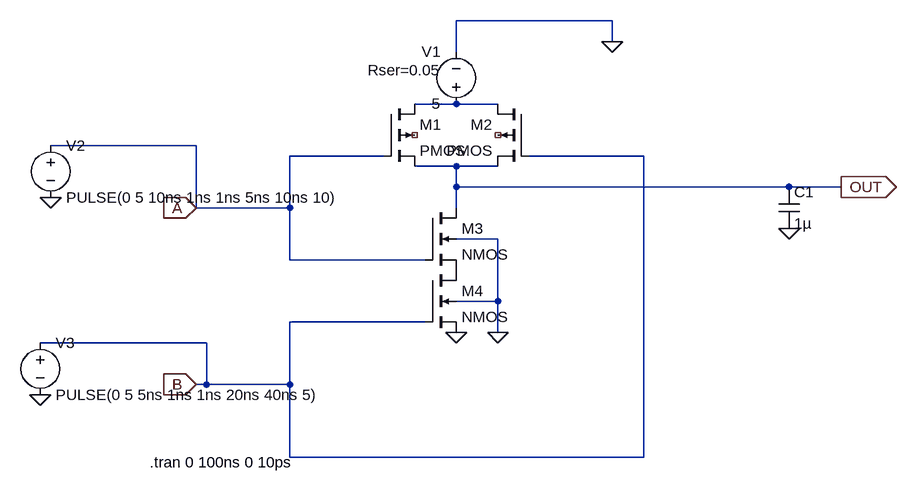
[diagram p0: schematic NAND.asc]
NAND.asc, the LTspice schematic file:
Version 4
SHEET 1 880 680
WIRE -256 -800 -496 -800
WIRE -256 -768 -256 -800
WIRE -496 -752 -496 -800
WIRE -496 -672 -560 -672
WIRE -432 -672 -496 -672
WIRE -896 -608 -1120 -608
WIRE -608 -592 -752 -592
WIRE -208 -592 -384 -592
WIRE -496 -576 -560 -576
WIRE -432 -576 -496 -576
WIRE -496 -544 -496 -576
WIRE 16 -544 -496 -544
WIRE 96 -544 16 -544
WIRE -896 -512 -896 -608
WIRE -752 -512 -752 -592
WIRE -752 -512 -896 -512
WIRE -496 -512 -496 -544
WIRE -432 -464 -496 -464
WIRE -752 -432 -752 -512
WIRE -544 -432 -752 -432
WIRE -432 -368 -432 -464
WIRE -432 -368 -496 -368
WIRE -544 -336 -752 -336
WIRE -432 -320 -432 -368
WIRE -880 -304 -1136 -304
WIRE -880 -240 -880 -304
WIRE -880 -240 -896 -240
WIRE -752 -240 -752 -336
WIRE -752 -240 -880 -240
WIRE -752 -128 -752 -240
WIRE -208 -128 -208 -592
WIRE -208 -128 -752 -128
FLAG -496 -320 0
FLAG -432 -320 0
FLAG -896 -512 A
IOPIN -896 -512 In
FLAG -896 -240 B
IOPIN -896 -240 In
FLAG 96 -544 OUT
IOPIN 96 -544 Out
FLAG 16 -480 0
FLAG -256 -768 0
FLAG -1120 -528 0
FLAG -1136 -224 0
SYMBOL nmos4 -544 -512 R0
SYMATTR InstName M3
SYMATTR Value2 l=180nm w=180nm
SYMBOL nmos4 -544 -416 R0
SYMATTR InstName M4
SYMATTR Value2 l=180nm w=180nm
SYMBOL cap 0 -544 R0
SYMATTR InstName C1
SYMATTR Value 1µ
SYMBOL voltage -496 -656 R180
WINDOW 0 24 96 Left 2
WINDOW 3 24 16 Left 2
WINDOW 123 0 0 Left 0
WINDOW 39 24 68 Left 2
SYMATTR InstName V1
SYMATTR Value 5
SYMATTR SpiceLine Rser=0.05
SYMBOL voltage -1120 -624 R0
WINDOW 123 0 0 Left 0
WINDOW 39 0 0 Left 0
SYMATTR InstName V2
SYMATTR Value PULSE(0 5 10ns 1ns 1ns 5ns 10ns 10)
SYMBOL voltage -1136 -320 R0
WINDOW 123 0 0 Left 0
WINDOW 39 0 0 Left 0
SYMATTR InstName V3
SYMATTR Value PULSE(0 5 5ns 1ns 1ns 20ns 40ns 5)
SYMBOL pmos4 -608 -672 R0
SYMATTR InstName M1
SYMATTR Value2 l=180nm w=180nm
SYMBOL pmos4 -384 -672 M0
SYMATTR InstName M2
SYMATTR Value2 l=180m w=180m
TEXT -968 -120 Left 2 !.tran 0 100ns 0 10ps

The netlist it stands for:
* NAND.asc
M3 OUT A P001 0 NMOS l=180nm w=180nm
M4 P001 B 0 0 NMOS l=180nm w=180nm
C1 OUT 0 1µ
V1 N001 0 5 Rser=0.05
V2 A 0 PULSE(0 5 10ns 1ns 1ns 5ns 10ns 10)
V3 B 0 PULSE(0 5 5ns 1ns 1ns 20ns 40ns 5)
M1 N001 A OUT NC_01 PMOS l=180nm w=180nm
M2 N001 B OUT NC_02 PMOS l=180m w=180m
.model NMOS NMOS
.model PMOS PMOS
.lib standard.mos
.tran 0 100ns 0 10ps
.backanno
.end